# Altium project project_zasetskiy_DC-DC.PrjPcb
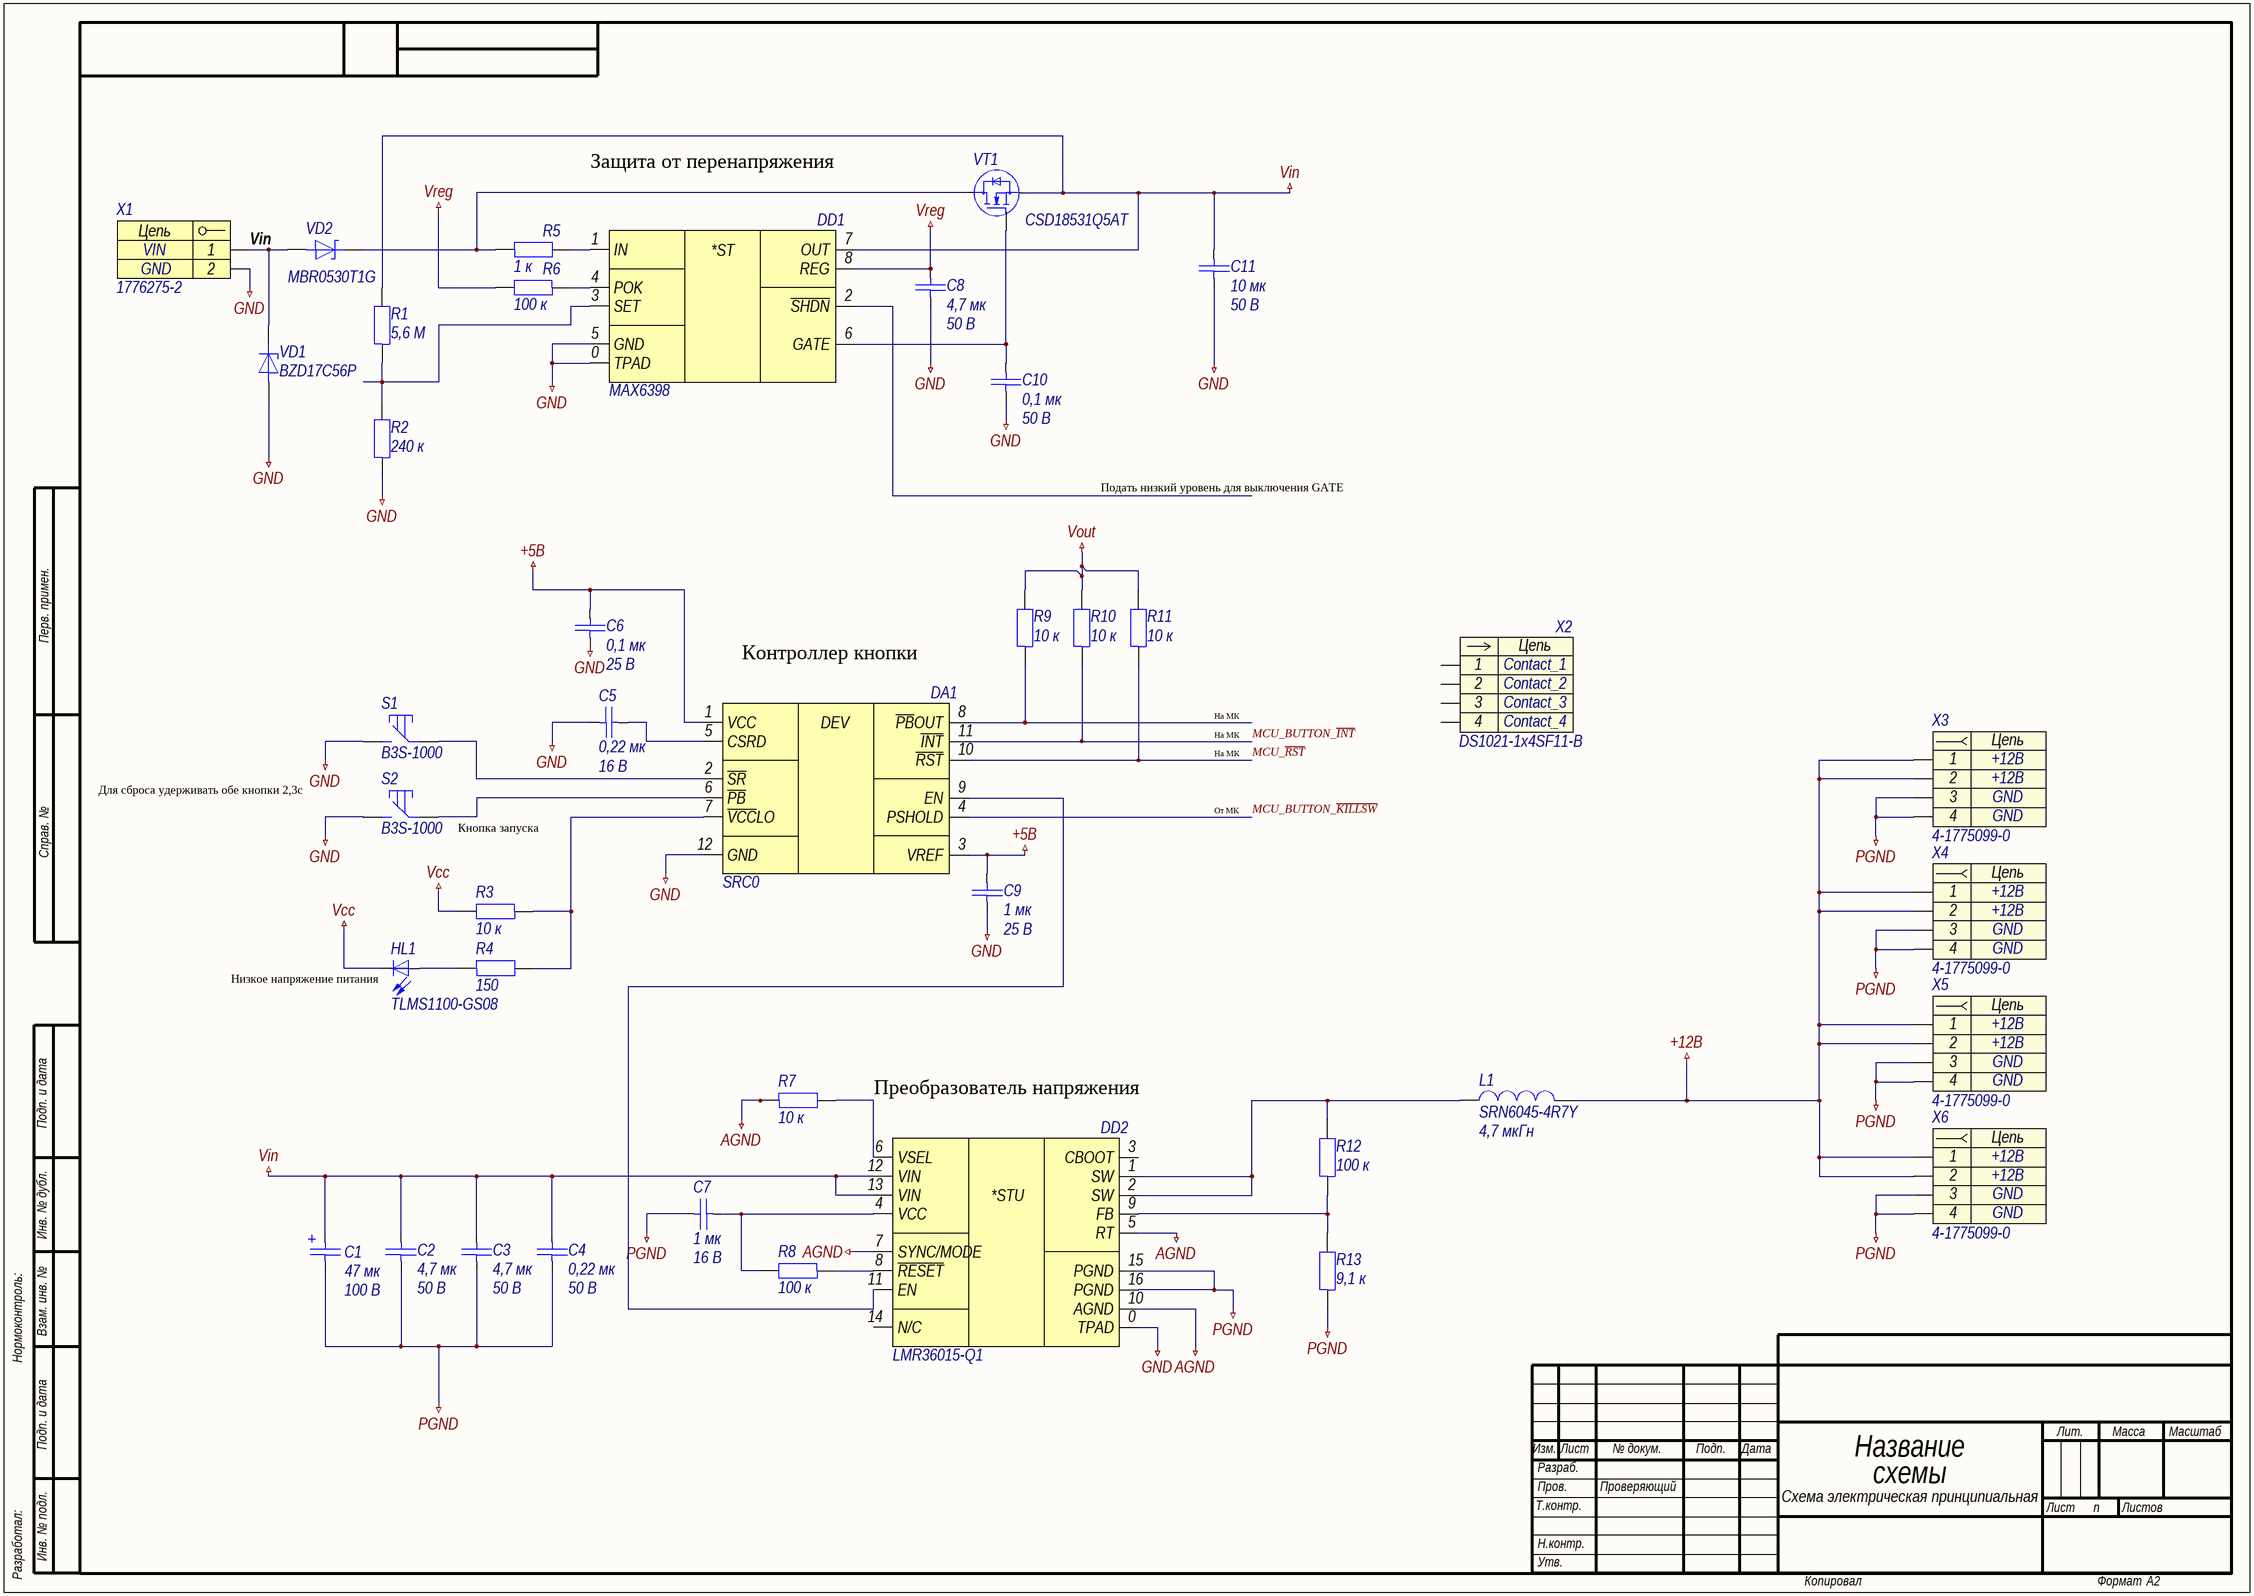
[diagram p0: project_zasetskiy_DC-DC.SchDoc]
approver: Утвердил; check: Проверяющий; designation: Введите номер сборки; developer: Разработчик; document_code: Ý3; document_type: Схема электрическая принципиальная; pcb_dec_number: Введите номер платы; project: Введите название проекта; sheets_total: M; title: Введите полное название схемы; title_line_1: Название; title_line_2: схемы
1 sheet, 40 parts. Net scope: global (net labels, ports and power ports of the same name join across sheets).
Board file: 1,5mm_18um_4layers_std.PcbDoc

## Sheet project_zasetskiy_DC-DC.SchDoc: Введите полное название схемы
size 594 x 420 mm; ApprovedBy: Утвердил; CheckedBy: Проверяющий; DrawnBy: Разработчик; DocumentNumber: Ââåäèòå íîìåð ñáîðêèÝ3; SheetNumber: n; SheetTotal: M; DocumentCode: Ý3; ImagePath: Введите номер платы

### Parts
C1  47 мк  Напряжение: 100 В  [CAPAE-1000X1000X1200]
C2  4,7 мк  Напряжение: 50 В  [C1206]
C3  4,7 мк  Напряжение: 50 В  [C1206]
C4  0,22 мк  Напряжение: 50 В  [C0603]
C5  0,22 мк  Напряжение: 16 В  [C0603]
C6  0,1 мк  Напряжение: 25 В  [C0402]
C7  1 мк  Напряжение: 16 В  [C0603]
C8  4,7 мк  Напряжение: 50 В  [C1206]
C9  1 мк  Напряжение: 25 В  [C0603]
C10  0,1 мк  Напряжение: 50 В  [C0603]
C11  10 мк  Напряжение: 50 В  [C1210]
DA1  SRC0
DD1  MAX6398
DD2  LMR36015-Q1
HL1  TLMS1100-GS08  [LED]
L1  SRN6045-4R7Y  Индуктивность: 4,7 мкГн  [SRN-2-600X600X450]
R1  5,6 M  [R0603]
R2  240 к  [R0603]
R3  10 к  [R0603]
R4  150  [R0603]
R5  1 к  [R0603]
R6  100 к  [R0603]
R7  10 к  [R0603]
R8  100 к  [R0603]
R9  10 к  [R0603]
R10  10 к  [R0603]
R11  10 к  [R0603]
R12  100 к  [R0603]
R13  9,1 к  [R0603]
S1  B3S-1000  [BUTTON]
S2  B3S-1000  [BUTTON]
VD1  BZD17C56P  [DO-219AB-280X180X108]
VD2  MBR0530T1G  [SOD-123-368X160X135]
VT1  CSD18531Q5AT  [VSONP-8-P127-600X500X110]
X1  1776275-2  [1776275-2]
X2  DS1021-1x4SF11-B  [DS1021-1X4SF11-B]
X3  4-1775099-0  [4-1775099-0]
X4  4-1775099-0  [4-1775099-0]
X5  4-1775099-0  [4-1775099-0]
X6  4-1775099-0  [4-1775099-0]

### Nets
+5В: C6.1 C9.1 DA1.1(VCC) DA1.3(VREF)
+12В: L1.2 X3.1 X3.2 X4.1 X4.2 X5.1 X5.2 X6.1 X6.2
AGND: DD2.5(RT) DD2.7(SYNC/MODE) DD2.10(AGND) R7.1
GND: C5.2 C6.2 C8.2 C9.2 C10.2 C11.2 DA1.12(GND) DD1.0(TPAD) DD1.5(GND) DD2.0(TPAD) R2.1 VD1.2 X1.2
PGND: C1.2 C2.2 C3.2 C4.2 C7.1 DD2.15(PGND) DD2.16(PGND) R13.1 X3.3 X3.4 X4.3 X4.4 X5.3 X5.4 X6.3 X6.4
Vcc: HL1.2(K) R3.2
Vin: C1.1 C2.1 C3.1 C4.1 C11.1 DD1.7(OUT) DD2.12(VIN) DD2.13(VIN) R1.2 VT1.S
Vout: R9.2 R10.2 R11.2
Vreg: C8.1 DD1.8(REG) R6.2
MCU_BUTTON_~{I}~{NT}: DA1.11(~{INT}) R10.1
MCU_BUTTON_~{KILLSW}: DA1.4(PSHOLD)
MCU_~{R}~{ST}: DA1.10(~{RST}) R11.1
NetC5_1: C5.1 DA1.5(CSRD)
NetC7_2: C7.2 DD2.4(VCC) R8.2
NetC10_1: C10.1 DD1.6(GATE) VT1.G
NetDA1_2: DA1.2(~{SR}) S1.2
NetDA1_6: DA1.6(~{PB}) S2.2
NetDA1_7: DA1.7(~{VCC}LO) R3.1 R4.2
NetDA1_8: DA1.8(~{PB}OUT) R9.1
NetDA1_9: DA1.9(EN) DD2.11(EN)
NetDD1_1: DD1.1(IN) R5.2
NetDD1_3: DD1.3(SET) R1.1 R2.2
NetDD1_4: DD1.4(POK) R6.1
NetDD2_1: DD2.1(SW) DD2.2(SW) L1.1 R12.2
NetDD2_6: DD2.6(VSEL) R7.2
NetDD2_8: DD2.8(~{RESET}) R8.1
NetDD2_9: DD2.9(FB) R12.1 R13.2
NetHL1_1: HL1.1(A) R4.1
NetR5_1: R5.1 VD2.1 VT1.D
NetVD1_1: VD1.1 VD2.2 X1.1

Not connected (* = marked no-connect by the designer): DD1 2(~{SHDN}); DD2 3(CBOOT) 14(N/C); S1 1; S2 1; X2 1 2 3 4

### Notes on the sheet
- Защита от перенапряжения
- Vin
- Подать низкий уровень для выключения GATE
- Контроллер кнопки
- На МК
- Для сброса удерживать обе кнопки 2,3с
- (near S2) Кнопка запуска
- От МК
- (near HL1) Низкое напряжение питания
- Преобразователь напряжения
- Перв. примен.
- Справ. №
- Подп. и дата
- Инв. № дубл.
- Нормоконтроль:
- Взам. инв. №
- Изм.
- Лист
- № докум.
- Подп.
- Дата
- Лит.
- Масса
- Масштаб
- Т.контр.
- Пров.
- Разраб.
- Листов
- Разработал:
- Инв. № подл.
- Н.контр.
- Утв.
- Копировал
- Формат
- А2
- (in symbol dd0003) *ST
- (in symbol dd0004) DEV
- (in symbol dd0005) *STU
- (in symbol x0006) Цепь
- (in symbol x0008) Цепь
- (in symbol x0027) Цепь

### Library data of the parts
C1 = c0165: =Описание; ID: c0165; Фамилия: Ларионов; Описание: Конденсатор электролитический алюминиевый 47 мкФ 100 В ±20 %; Наименование: MAL214699904E3; Производитель: Vishay Intertechnology, Inc.; Отклонение: ±20 %; Эквивалентное последовательное сопротивление: 4,1 Ом; Среднеквадратичный размах пульсации тока: 0,23 А; Рабочие температуры: от –55 °С до +125 °С; Корпус: CAPAE (10 x 10 x 12); Номинал: 47 мк; Номинальное напряжение: 100 В; HelpURL: https://www.vishay.com/capacitors/list/product-28403/
C2 C3 C8 = c0119: =Описание; ID: c0119; Фамилия: Паньков; Описание: Конденсатор керамический чип 1206 4,7 мкФ 50 В ±10 %; Наименование: CC1206KKX7R9BB475; Производитель: YAGEO Corp.; Отклонение: ±10 %; Рабочие температуры: от –55 °С до +125 °С; Температурный коэффициент емкости: X7R; Корпус: 1206; Номинал: 4,7 мк; Номинальное напряжение: 50 В; HelpURL: https://www.yageo.com/upload/media/product/productsearch/datasheet/mlcc/UPY-GPHC_X7R_6.3V-to-50V_20.pdf
C4 = c0077: =Описание; ID: c0077; Фамилия: Самарин; Описание: Конденсатор керамический чип 0603 220 нФ 50 В ±5 %; Наименование: CC0603JRX7R9BB224; Производитель: YAGEO Corp.; Отклонение: ±5 %; Рабочие температуры: от –55 °С до +125 °С; Температурный коэффициент емкости: X7R; Корпус: 0603; Номинал: 0,22 мк; Номинальное напряжение: 50 В; HelpURL: https://www.yageo.com/upload/media/product/productsearch/datasheet/mlcc/UPY-GPHC_X7R_6.3V-to-50V_20.pdf
C5 = c0072: =Описание; ID: c0072; Фамилия: Паньков; Описание: Конденсатор керамический чип 0603 220 нФ 16 В ±10 %; Наименование: CC0603KRX5R7BB224; Производитель: YAGEO Corp.; Отклонение: ±10 %; Рабочие температуры: от –55 °С до +85 °С; Температурный коэффициент емкости: X5R; Корпус: 0603; Номинал: 0,22 мк; Номинальное напряжение: 16 В; HelpURL: https://www.yageo.com/upload/media/product/productsearch/datasheet/mlcc/UPY-GPHC_X5R_4V-to-50V_26.pdf
C6 = c0062: =Описание; ID: c0062; Фамилия: Паньков; Описание: Конденсатор керамический чип 0402 100 нФ 25 В ±10 %; Наименование: CC0402KRX5R8BB104; Производитель: YAGEO Corp.; Отклонение: ±10 %; Рабочие температуры: от –55 °С до +85 °С; Температурный коэффициент емкости: X5R; Корпус: 0402; Номинал: 0,1 мк; Номинальное напряжение: 25 В; HelpURL: https://www.yageo.com/upload/media/product/productsearch/datasheet/mlcc/UPY-GPHC_X5R_4V-to-50V_26.pdf
C7 = c0093: =Описание; ID: c0093; Фамилия: Паньков; Описание: Конденсатор керамический чип 0603 1 мкФ 16 В ±10 %; Наименование: CC0603KRX7R7BB105; Производитель: YAGEO Corp.; Отклонение: ±10 %; Рабочие температуры: от –55 °С до +125 °С; Температурный коэффициент емкости: X7R; Корпус: 0603; Номинал: 1 мк; Номинальное напряжение: 16 В; HelpURL: https://www.yageo.com/upload/media/product/productsearch/datasheet/mlcc/UPY-GPHC_X7R_6.3V-to-50V_20.pdf
C9 = c0094: =Описание; ID: c0094; Фамилия: Паньков; Описание: Конденсатор керамический чип 0603 1 мкФ 25 В ±10 %; Наименование: CC0603KRX5R8BB105; Производитель: YAGEO Corp.; Отклонение: ±10 %; Рабочие температуры: от –55 °С до +85 °С; Температурный коэффициент емкости: X5R; Корпус: 0603; Номинал: 1 мк; Номинальное напряжение: 25 В; HelpURL: https://www.yageo.com/upload/media/product/productsearch/datasheet/mlcc/UPY-GPHC_X5R_4V-to-50V_26.pdf
C10 = c0066: =Описание; ID: c0066; Фамилия: Паньков; Описание: Конденсатор керамический чип 0603 100 нФ 50 В ±10 %; Наименование: CC0603KRX7R9BB104; Производитель: YAGEO Corp.; Отклонение: ±10 %; Рабочие температуры: от –55 °С до +125 °С; Температурный коэффициент емкости: X7R; Корпус: 0603; Номинал: 0,1 мк; Номинальное напряжение: 50 В; HelpURL: https://www.yageo.com/upload/media/product/productsearch/datasheet/mlcc/UPY-GPHC_X7R_6.3V-to-50V_20.pdf
C11 = c0131: =Описание; ID: c0131; Фамилия: Паньков; Описание: Конденсатор керамический чип 1210 10 мкФ 50 В ±10 %; Наименование: CC1210KKX7R9BB106; Производитель: YAGEO Corp.; Отклонение: ±10 %; Рабочие температуры: от –55 °С до +125 °С; Температурный коэффициент емкости: X7R; Корпус: 1210; Номинал: 10 мк; Номинальное напряжение: 50 В; HelpURL: https://www.yageo.com/upload/media/product/productsearch/datasheet/mlcc/UPY-GPHC_X7R_6.3V-to-50V_20.pdf
DA1 = dd0004: =Описание; ID: dd0004; Фамилия: Засецкий; Описание: Контроллер кнопки TDFN12; Производитель: ST Microelectronics; Рабочие температуры: от -40 °С до +85 °С; Корпус: TDFN-12; Наименование: SRC0; HelpURL: https://www.st.com/en/reset-and-supervisor-ics/src0.html
DD1 = dd0003: =Описание; ID: dd0003; Фамилия: Засецкий; Описание: ИС для защиты от перенапряжения и пониженнного напряжения; Производитель: maxim integrated; Рабочие температуры: от -40 °С до +125 °С; Корпус: TDFN-8; Наименование: MAX6398; HelpURL: https://datasheets.maximintegrated.com/en/ds/MAX6397-MAX6398.pdf
DD2 = dd0005: =Описание; ID: dd0005; Фамилия: Засецкий; Описание: Преобразователь напряжения понижающий; Производитель: Texas Instruments; Рабочие температуры: от -40 °С до +150 °С; Корпус: HTSSOP; Наименование: LMR36015-Q1; HelpURL: https://www.ti.com/lit/ds/symlink/lm63635-q1.pdf?ts=1618129399539&ref_url=https%253A%252F%252Fwww.ti.com%252Fproduct%252FLM63635-Q1
HL1 = hl0001: =Описание; ID: hl0001; Фамилия: Засецкий; Описание: Светодиод красный чип 0603; Производитель: Vishay; Рабочие температуры: от -40 °С до +100 °С; Номинальный ток: 30 мА; Корпус: 0603; Примечание: Красный; Наименование: TLMS1100-GS08; HelpURL: https://www.vishay.com/docs/83173/tlmb1100.pdf
L1 = l0006: =Описание; ID: l0006; Фамилия: Соколов; Описание: Катушка индуктивности 4,7 мкГн ±30 %; Производитель: Bourns, Inc.; Отклонение: ±30 %; Номинальное активное сопротивление: 37,6 мОм; Резонансная частота: 22 МГц; Номинальный ток (при нагреве на 20 °С/40 °С): 3 А; Ток насыщения: 4 А; Рабочее напряжение: не указано; Рабочие температуры: от –40 °С до +125 °С; Корпус: 6,0 x 6,0 x 4,5; Наименование: SRN6045-4R7Y; Номинал: 4,7 мкГн; Максимальное активное сопротивление: 37,6 мОм; HelpURL: https://www.bourns.com/products/magnetic-products/power-inductors-smd-semi-shielded/product/SRN6045
R1 = r0175: =Описание; ID: r0175; Фамилия: Шкабара; Описание: Резистор чип 0603 5,36 МОм ±1 % 0,1 Вт; Наименование: RC0603FR-075M36L; Производитель: YAGEO Corp.; Номинал: 5,36 M; Отклонение: ±1 %; Номинальное напряжение: 75 В; Номинальный ток: 1 А; Рабочие температуры: от –55 °С до +155 °С; Корпус: 0603; HelpURL: https://www.yageo.com/upload/media/product/productsearch/datasheet/rchip/PYu-RC_Group_51_RoHS_L_11.pdf
R2 = r0155: =Описание; ID: r0155; Фамилия: Паньков; Описание: Резистор чип 0603 240 кОм ±1 % 0,1 Вт; Наименование: RC0603FR-07240KL; Производитель: YAGEO Corp.; Отклонение: ±1 %; Номинальное напряжение: 75 В; Номинальный ток: 1 А; Рабочие температуры: от –55 °С до +155 °С; Корпус: 0603; Примечание: Ряд E24; Номинал: 240 к; HelpURL: https://www.yageo.com/upload/media/product/productsearch/datasheet/rchip/PYu-RC_Group_51_RoHS_L_11.pdf
R3 R7 R9-R11 = r0105: =Описание; ID: r0105; Фамилия: Самарин; Описание: Резистор чип 0603 10 кОм ±1 % 0,1 Вт; Наименование: RC0603FR-0710KL; Производитель: YAGEO Corp.; Отклонение: ±1 %; Номинальное напряжение: 75 В; Номинальный ток: 1 А; Рабочие температуры: от –55 °С до +155 °С; Корпус: 0603; Примечание: Ряд E24; Номинал: 10 к; HelpURL: https://www.yageo.com/upload/media/product/productsearch/datasheet/rchip/PYu-RC_Group_51_RoHS_L_11.pdf
R4 = r0056: =Описание; ID: r0056; Фамилия: Паньков; Описание: Резистор чип 0603 150 Ом ±1 % 0,1 Вт; Наименование: RC0603FR-07150RL; Производитель: YAGEO Corp.; Отклонение: ±1 %; Номинальное напряжение: 75 В; Номинальный ток: 1 А; Рабочие температуры: от –55 °С до +155 °С; Корпус: 0603; Примечание: Ряд E24; Номинал: 150; HelpURL: https://www.yageo.com/upload/media/product/productsearch/datasheet/rchip/PYu-RC_Group_51_RoHS_L_11.pdf
R5 = r0076: =Описание; ID: r0076; Фамилия: Ларионов; Описание: Резистор чип 0603 1 кОм ±1 % 0,1 Вт; Наименование: RC0603FR-071KL; Производитель: YAGEO Corp.; Отклонение: ±1 %; Номинальное напряжение: 75 В; Номинальный ток: 1 А; Рабочие температуры: от –55 °С до +155 °С; Корпус: 0603; Примечание: Ряд E24; Номинал: 1 к; HelpURL: https://www.yageo.com/upload/media/product/productsearch/datasheet/rchip/PYu-RC_Group_51_RoHS_L_11.pdf
R6 R8 R12 = r0141: =Описание; ID: r0141; Фамилия: Водорезов; Описание: Резистор чип 0603 100 кОм ±1 % 0,1 Вт; Наименование: RC0603FR-07100KL; Производитель: YAGEO Corp.; Отклонение: ±1 %; Номинальное напряжение: 75 В; Номинальный ток: 1 А; Рабочие температуры: от –55 °С до +155 °С; Корпус: 0603; Примечание: Ряд E24; Номинал: 100 к; HelpURL: https://www.yageo.com/upload/media/product/productsearch/datasheet/rchip/PYu-RC_Group_51_RoHS_L_11.pdf
R13 = r0104: =Описание; ID: r0104; Фамилия: Паньков; Описание: Резистор чип 0603 9,1 кОм ±1 % 0,1 Вт; Наименование: RC0603FR-079K1L; Производитель: YAGEO Corp.; Отклонение: ±1 %; Номинальное напряжение: 75 В; Номинальный ток: 1 А; Рабочие температуры: от –55 °С до +155 °С; Корпус: 0603; Примечание: Ряд E24; Номинал: 9,1 к; HelpURL: https://www.yageo.com/upload/media/product/productsearch/datasheet/rchip/PYu-RC_Group_51_RoHS_L_11.pdf
S1 S2 = sw0001: =Описание; ID: sw0001; Фамилия: Засецкий; Описание: Кнопка; Производитель: Omron; Наименование: B3S-1000; HelpURL: https://omronfs.omron.com/en_US/ecb/products/pdf/en-b3s.pdf
VD1 = vd0030: =Описание; ID: vd0030; Фамилия: Жернаков; Описание: Стабилитрон 56 В; Производитель: Vishay Intertechnology, Inc.; Номинальное напряжение стабилизации: 56 В; Разброс напряжения стабилизации: 52,0…60,0 В; Номинальный ток стабилизации: 10 мА; Рабочие температуры: от –55 °С до +150 °С; Корпус: DO-219AB; Наименование: BZD17C56P; HelpURL: https://www.vishay.com/product?docid=85161
VD2 = vd0001: =Описание; ID: vd0001; Фамилия: Шкабара; Описание: Диод Шоттки 30 В 0,5 А; Производитель: ON Semiconductor; Максимальное прямое напряжение: 0,43 В; Максимальное обратное напряжение: 30 В; Максимальный прямой ток: 0,5 А; Рабочие температуры: от –65 °С до +125 °С; Корпус: SOD-123; Наименование: MBR0530T1G; HelpURL: https://www.onsemi.com/products/discretes-drivers/diodes-rectifiers/schottky-diodes-schottky-rectifiers/mbr0530t1g
VT1 = vt0004: =Описание; ID: vt0004; Фамилия: Паньков; Описание: Полевой N-канальный МДП-транзистор 60 В 19 А; Производитель: Texas Instruments Inc.; Напряжение затвор — исток: ±20 В; Напряжение сток — исток: 60 В; Ток стока: 19 А; Сопротивление сток — исток: 5,8 мОм; Рабочие температуры: от –55 °С до +150 °С; Корпус: SON-8; Наименование: CSD18531Q5AT; HelpURL: https://www.ti.com/product/CSD18531Q5A
X1 = x0008: =Описание; Contact_1: VIN; Contact_2: GND; ID: x0008; Фамилия: Паньков; Описание: Terminal Block 2 pin 3,5 мм; Производитель: TE Connectivity; Наименование: 1776275-2; HelpURL: https://www.te.com/usa-en/product-1776275-2.html
X2 = x0027: =Описание; ID: x0027; Фамилия: Паньков; Описание: PLS 4 pin 2,54 мм вилка прямой; Производитель: Connfly Electronic Co., Ltd.; Contact_1: Contact_1; Contact_2: Contact_2; Contact_3: Contact_3; Contact_4: Contact_4; Наименование: DS1021-1x4SF11-B; HelpURL: http://en.connfly.group/product/xVkr=EusQssAN0gN=Aos=mU+UrVkR9kqEAN0gN9g+WqANB+A
X3-X6 = x0006: =Описание; Contact_1: +12В; Contact_3: GND; ID: x0006; Фамилия: Ларионов; Описание: ATX Power 4 pin гнездо прямой; Производитель: TE Connectivity; Contact_2: +12В; Contact_4: GND; Наименование: 4-1775099-0; HelpURL: https://www.te.com/usa-en/product-4-1775099-0.html